# EAGLE schematic sw63_mk3_jig (EAGLE 9.6.2)
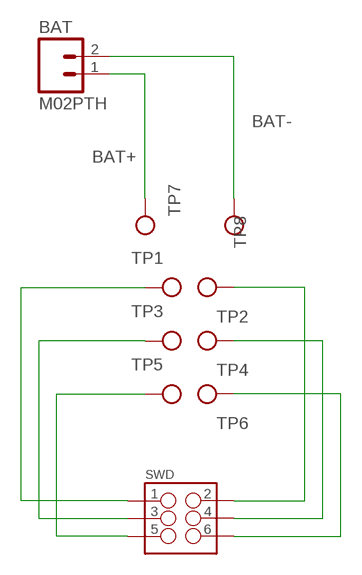
[diagram p0: schematic, sheet 1]

## Parts
BAT  M02PTH  [1X02]
SWD  M03X2POGO_ROUND  [2X3_POGO_ROUND]
TP1  R-075-SC  [R-075]
TP2  R-075-SC  [R-075]
TP3  R-075-SC  [R-075]
TP4  R-075-SC  [R-075]
TP5  R-075-SC  [R-075]
TP6  R-075-SC  [R-075]
TP7  R-075-SC  [R-075]
TP8  R-075-SC  [R-075]

## Nets
BAT+: BAT.1 TP7.P$1
BAT-: BAT.2 TP8.P$1
N$6: SWD.P$1 TP1.P$1
N$14: SWD.P$3 TP3.P$1
N$35: SWD.P$5 TP5.P$1
N$36: SWD.P$6 TP6.P$1
N$37: SWD.P$4 TP4.P$1
N$38: SWD.P$2 TP2.P$1

## Library data of the parts
BAT = BASTL_PINHEADERS:M02: Standard 2-pin 0.1" header. Use with - straight break away headers ( PRT-00116) - right angle break away headers (PRT-00553) - swiss pins (PRT-00743) - machine pins (PRT-00117) - female headers (PRT-00115) Molex polarized connector foot print use with: PRT-08233 with associated crimp pins and housings. 2.54_SCREWTERM for use with PRT-10571. 3.5mm Screw Terminal footprints for PRT-08084 5mm Screw Terminal footprints for use with PRT-08433; ASSEMBLED: yes; TYPE: THT
SWD = BASTL_PINHEADERS:M03X2: 2x3 .1" header. Shrouded, with keying- CONN-10681 SMT- CONN-11415 Pogo pins- HW-11044
TP1-TP8 = BASTL_TESTJIG:R-075-SC